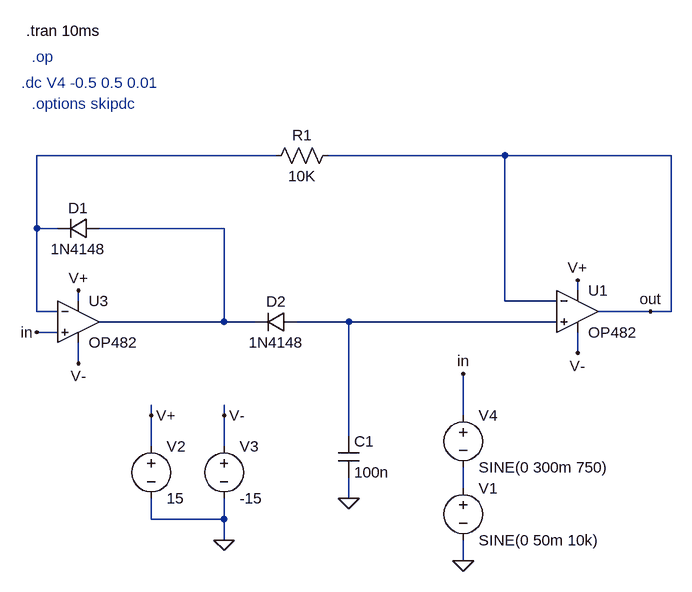
[diagram p0: schematic Etaj 4 - PEAK DETECTOR.asc]
Etaj 4 - PEAK DETECTOR.asc, the LTspice schematic file:
Version 4.1
SHEET 1 1224 880
WIRE 240 -288 -128 -288
WIRE 592 -288 320 -288
WIRE 848 -288 592 -288
WIRE -128 -176 -128 -288
WIRE -96 -176 -128 -176
WIRE 160 -176 -32 -176
WIRE 704 -80 704 -96
WIRE -64 -64 -64 -80
WIRE 592 -64 592 -288
WIRE 672 -64 592 -64
WIRE -128 -48 -128 -176
WIRE -96 -48 -128 -48
WIRE 816 -48 736 -48
WIRE 848 -48 848 -288
WIRE 848 -48 816 -48
WIRE 160 -32 160 -176
WIRE 160 -32 -32 -32
WIRE 208 -32 160 -32
WIRE 352 -32 272 -32
WIRE 672 -32 352 -32
WIRE -96 -16 -128 -16
WIRE 704 16 704 -16
WIRE -64 32 -64 0
WIRE 48 112 48 96
WIRE 160 112 160 96
WIRE 528 112 528 48
WIRE 352 144 352 -32
WIRE 48 160 48 112
WIRE 160 160 160 112
WIRE 528 224 528 192
WIRE 352 240 352 208
WIRE 48 272 48 240
WIRE 160 272 160 240
WIRE 160 272 48 272
WIRE 160 304 160 272
WIRE 528 336 528 304
FLAG 528 336 0
FLAG 160 304 0
FLAG 48 112 V+
FLAG 160 112 V-
FLAG -64 -80 V+
FLAG -64 32 V-
FLAG 704 -96 V+
FLAG 704 16 V-
FLAG 352 240 0
FLAG 528 48 in
FLAG -128 -16 in
FLAG 816 -48 out
SYMBOL voltage 528 208 R0
WINDOW 123 0 0 Left 2
WINDOW 39 0 0 Left 2
SYMATTR InstName V1
SYMATTR Value SINE(0 50m 10k)
SYMBOL voltage 48 144 R0
WINDOW 123 0 0 Left 2
WINDOW 39 0 0 Left 2
SYMATTR InstName V2
SYMATTR Value 15
SYMBOL voltage 160 144 R0
WINDOW 123 0 0 Left 2
WINDOW 39 0 0 Left 2
SYMATTR InstName V3
SYMATTR Value -15
SYMBOL diode -32 -160 M270
WINDOW 0 32 32 VTop 2
WINDOW 3 0 32 VBottom 2
SYMATTR InstName D1
SYMATTR Value 1N4148
SYMBOL diode 272 -16 M270
WINDOW 0 32 32 VTop 2
WINDOW 3 0 32 VBottom 2
SYMATTR InstName D2
SYMATTR Value 1N4148
SYMBOL res 336 -304 R90
WINDOW 0 0 56 VBottom 2
WINDOW 3 32 56 VTop 2
SYMATTR InstName R1
SYMATTR Value 10K
SYMBOL cap 336 144 R0
SYMATTR InstName C1
SYMATTR Value 100n
SYMBOL voltage 528 96 R0
WINDOW 123 0 0 Left 2
WINDOW 39 0 0 Left 2
SYMATTR InstName V4
SYMATTR Value SINE(0 300m 750)
SYMBOL OpAmps\\OP482 -64 -96 R0
SYMATTR InstName U3
SYMBOL OpAmps\\OP482 704 -112 R0
SYMATTR InstName U1
TEXT -144 -480 Left 2 !.tran 10ms
TEXT -136 -440 Left 2 ;.op
TEXT -152 -400 Left 2 ;.dc V4 -0.5 0.5 0.01
TEXT -136 -368 Left 2 ;.options skipdc

The netlist it stands for:
* Etaj 4 - PEAK DETECTOR.asc
V1 N004 0 SINE(0 50m 10k)
V2 V+ 0 15
V3 V- 0 -15
D1 N002 N001 1N4148
D2 N003 N002 1N4148
R1 out N001 10K
C1 N003 0 100n
V4 in N004 SINE(0 300m 750)
X§U3 in N001 V+ V- N002 OP482  ; pins In+ In- V+ V- OUT
X§U1 N003 out V+ V- out OP482  ; pins In+ In- V+ V- OUT
.model D D
.lib standard.dio
.tran 10ms
* .op
* .dc V4 -0.5 0.5 0.01
* .options skipdc
.backanno
.end